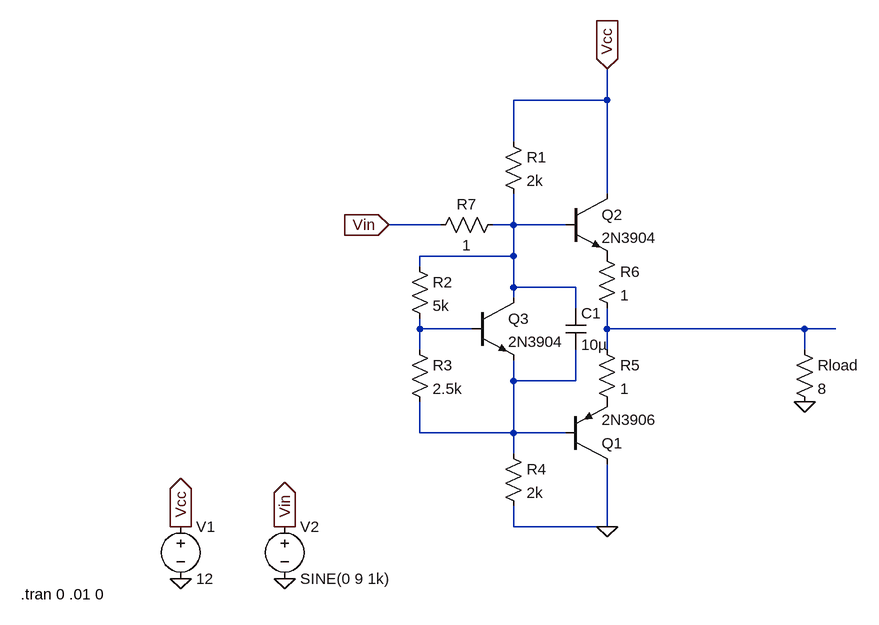
[diagram p0: schematic 411SoundControl.asc]
411SoundControl.asc, the LTspice schematic file:
Version 4
SHEET 1 1016 680
WIRE 624 -208 624 -256
WIRE 624 -208 480 -208
WIRE 480 -144 480 -208
WIRE 624 -64 624 -208
WIRE 368 -16 288 -16
WIRE 480 -16 480 -64
WIRE 480 -16 448 -16
WIRE 560 -16 480 -16
WIRE 480 32 480 -16
WIRE 480 32 336 32
WIRE 336 48 336 32
WIRE 480 80 480 32
WIRE 576 80 480 80
WIRE 480 96 480 80
WIRE 576 112 576 80
WIRE 336 144 336 128
WIRE 416 144 336 144
WIRE 624 144 624 112
WIRE 928 144 624 144
WIRE 976 144 928 144
WIRE 336 176 336 144
WIRE 624 176 624 144
WIRE 928 176 928 144
WIRE 480 224 480 192
WIRE 576 224 576 176
WIRE 576 224 480 224
WIRE 336 304 336 256
WIRE 480 304 480 224
WIRE 480 304 336 304
WIRE 560 304 480 304
WIRE 480 336 480 304
WIRE 480 448 480 416
WIRE 624 448 624 352
WIRE 624 448 480 448
FLAG 928 256 0
FLAG -32 528 0
FLAG 128 528 0
FLAG -32 448 Vcc
IOPIN -32 448 Out
FLAG 624 -256 Vcc
IOPIN 624 -256 In
FLAG 128 448 Vin
IOPIN 128 448 Out
FLAG 288 -16 Vin
IOPIN 288 -16 In
FLAG 624 448 0
SYMBOL res 464 -160 R0
SYMATTR InstName R1
SYMATTR Value 2k
SYMBOL res 320 32 R0
SYMATTR InstName R2
SYMATTR Value 5k
SYMBOL res 320 160 R0
SYMATTR InstName R3
SYMATTR Value 2.5k
SYMBOL npn 560 -64 R0
SYMATTR InstName Q2
SYMATTR Value 2N3904
SYMBOL res 608 160 R0
SYMATTR InstName R5
SYMATTR Value 1
SYMBOL res 608 16 R0
SYMATTR InstName R6
SYMATTR Value 1
SYMBOL res 912 160 R0
SYMATTR InstName Rload
SYMATTR Value 8
SYMBOL voltage -32 432 R0
WINDOW 123 0 0 Left 0
WINDOW 39 0 0 Left 0
SYMATTR InstName V1
SYMATTR Value 12
SYMBOL voltage 128 432 R0
WINDOW 123 0 0 Left 0
WINDOW 39 0 0 Left 0
SYMATTR InstName V2
SYMATTR Value SINE(0 9 1k)
SYMBOL res 464 -32 R90
WINDOW 0 0 56 VBottom 2
WINDOW 3 32 56 VTop 2
SYMATTR InstName R7
SYMATTR Value 1
SYMBOL pnp 560 352 M180
SYMATTR InstName Q1
SYMATTR Value 2N3906
SYMBOL res 464 320 R0
SYMATTR InstName R4
SYMATTR Value 2k
SYMBOL npn 416 96 R0
SYMATTR InstName Q3
SYMATTR Value 2N3904
SYMBOL cap 560 112 R0
SYMATTR InstName C1
SYMATTR Value 10µ
TEXT -278 552 Left 2 !.tran 0 .01 0

The netlist it stands for:
* 411SoundControl.asc
R1 Vcc N001 2k
R2 N001 N002 5k
R3 N002 N004 2.5k
Q2 Vcc N001 P001 0 2N3904
R5 N003 P002 1
R6 P001 N003 1
Rload N003 0 8
V1 Vcc 0 12
V2 Vin 0 SINE(0 9 1k)
R7 N001 Vin 1
Q1 0 N004 P002 0 2N3906
R4 N004 0 2k
Q3 N001 N002 N004 0 2N3904
C1 N001 N004 10µ
.model NPN NPN
.model PNP PNP
.lib standard.bjt
.tran 0 .01 0
.backanno
.end